# EAGLE design Esquema (EAGLE 9.6.2)
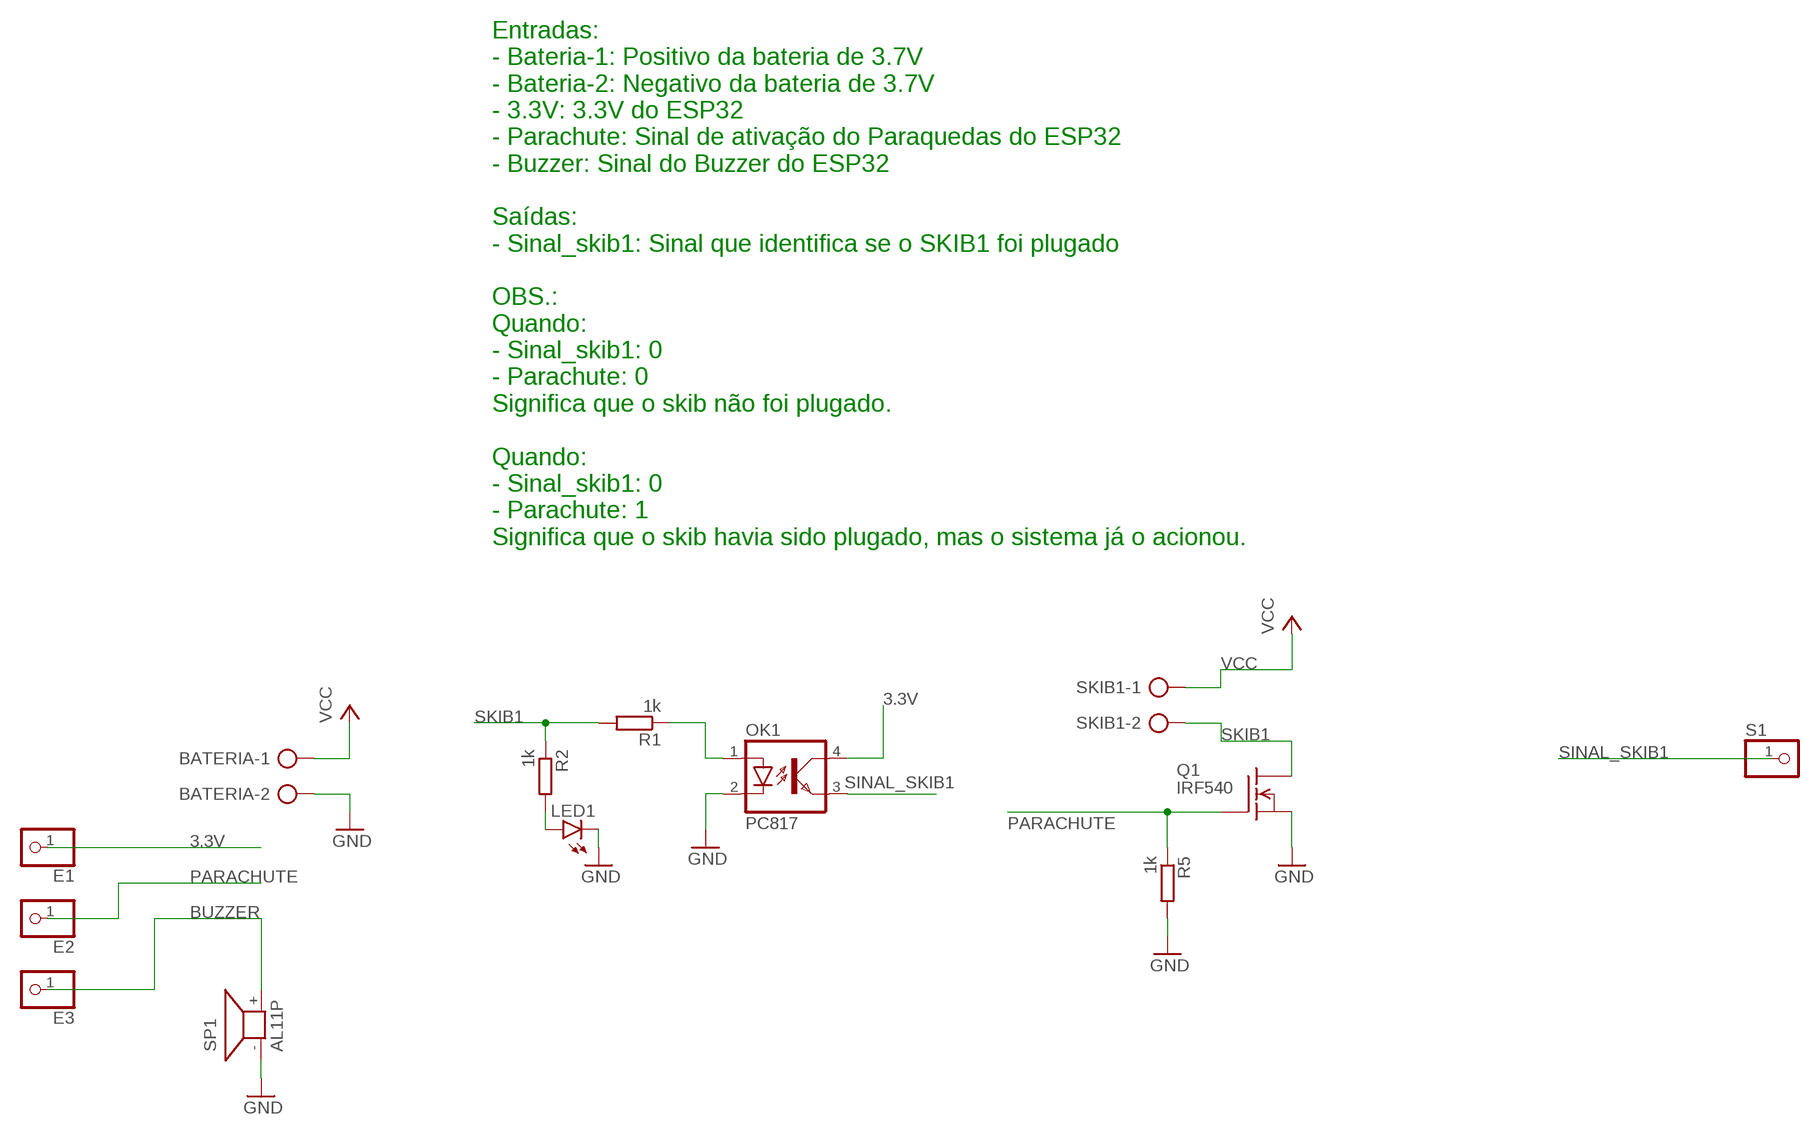
[diagram p0: schematic, sheet 1]

## Parts
BATERIA  AK500/2-H  [AK500/2-H]
E1  PINHD-1X1  [1X01]
E2  PINHD-1X1  [1X01]
E3  PINHD-1X1  [1X01]
LED1  LED5MM  [LED5MM]
OK1  PC817  [DIL04]
Q1  IRF540  [TO220]
R1  1k  R-EU_0207/10  [0207/10]
R2  1k  R-EU_0207/10  [0207/10]
R5  1k  R-EU_0207/10  [0207/10]
S1  PINHD-1X1  [1X01]
SKIB1  AK500/2-H  [AK500/2-H]
SP1  AL11P  [AL11P]

## Nets
3.3V: E1.1 OK1.4(COL)
BUZZER: E3.1 SP1.+
GND: BATERIA.2 LED1.K(C) OK1.2(C) Q1.3(S) R5.2 SP1.-
N$1: OK1.1(A) R1.1
N$4: LED1.A R2.2
PARACHUTE: E2.1 Q1.1(G) R5.1
SINAL_SKIB1: OK1.3(EMIT) S1.1
SKIB1: Q1.2(D) R1.2 R2.1 SKIB1.2
VCC: BATERIA.1 SKIB1.1

## Notes on the sheet
- Entradas:
  - Bateria-1: Positivo da bateria de 3.7V
  - Bateria-2: Negativo da bateria de 3.7V
  - 3.3V: 3.3V do ESP32
  - Parachute: Sinal de ativação do Paraquedas do ESP32
  - Buzzer: Sinal do Buzzer do ESP32
  
  Saídas:
  - Sinal_skib1: Sinal que identifica se o SKIB1 foi plugado
  
  OBS.:
  Quando:
  - Sinal_skib1: 0
  - Parachute: 0
  Significa que o skib não foi plugado.
  
  Quando:
  - Sinal_skib1: 0
  - Parachute: 1
  Significa que o skib havia sido plugado, mas o sistema já o acionou.

## Library data of the parts
BATERIA SKIB1 = con-ptr500:AK500/2-H: CONNECTOR Aug. 2004 / PTR Meßtechnik: Die Bezeichnung der Serie AK505 wurde geändert. Es handelt sich hierbei um AK500 in horizontaler Ausführung.; OC_FARNELL: unknown; OC_NEWARK: unknown
E1-E3 S1 = pinhead:PINHD-1X1: PIN HEADER
LED1 = led:LED: LED OSRAM: - CHIPLED LG R971, LG N971, LY N971, LG Q971, LY Q971, LO R971, LY R971 LH N974, LH R974 LS Q976, LO Q976, LY Q976 LO Q996 - Hyper CHIPLED LW Q18S LB Q993, LB Q99A, LB R99A - SideLED LS A670, LO A670, LY A670, LG A670, LP A670 LB A673, LV A673, LT A673, LW A673 LH A674 LY A675 LS A676, LA A676, LO A676, LY A676, LW A676 LS A679, LY A679, LG A679 - Hyper Micro SIDELED® LS Y876, LA Y876, LO Y876, LY Y876 LT Y87S - SmartLED LW L88C, LW L88S LB L89C, LB L89S, LG L890 LS L89K, LO L89K, LY L89K LS L896, LA L896, LO L896, LY L896 - TOPLED LS T670, LO T670, LY T670, LG T670, LP T670 LSG T670, LSP T670, LSY T670, LOP T670, LYG T670 LG T671, LOG T671, LSG T671 LB T673, LV T673, LT T673, LW T673 LH T674 LS T676, LA T676, LO T676, LY T676, LB T676, LH T676, LSB T676, LW T676 LB T67C, LV T67C, LT T67C, LS T67K, LO T67K, LY T67K, LW E67C LS E67B, LA E67B, LO E67B, LY E67B, LB E67C, LV E67C, LT E67C LW T67C LS T679, LY T679, LG T679 LS T770, LO T770, LY T770, LG T770, LP T770 LB T773, LV T773, LT T773, LW T773 LH T774 LS E675, LA E675, LY E675, LS T675 LS T776, LA T776, LO T776, LY T776, LB T776 LHGB T686 LT T68C, LB T68C - Hyper Mini TOPLED® LB M676 - Mini TOPLED Santana® LG M470 LS M47K, LO M47K, LY M47K Source: http://www.osram.convergy.de LUXEON: - LUMILED® LXK2-PW12-R00, LXK2-PW12-S00, LXK2-PW14-U00, LXK2-PW14-V00 LXK2-PM12-R00, LXK2-PM12-S00, LXK2-PM14-U00 LXK2-PE12-Q00, LXK2-PE12-R00, LXK2-PE12-S00, LXK2-PE14-T00, LXK2-PE14-U00 LXK2-PB12-K00, LXK2-PB12-L00, LXK2-PB12-M00, LXK2-PB14-N00, LXK2-PB14-P00, LXK2-PB14-Q00 LXK2-PR12-L00, LXK2-PR12-M00, LXK2-PR14-Q00, LXK2-PR14-R00 LXK2-PD12-Q00, LXK2-PD12-R00, LXK2-PD12-S00 LXK2-PH12-R00, LXK2-PH12-S00 LXK2-PL12-P00, LXK2-PL12-Q00, LXK2-PL12-R00 Source: www.luxeon.com KINGBRIGHT: KA-3528ASYC Source: www.kingbright.com
OK1 = optocoupler:PC817: SHARP OPTO COUPLER; MPN: PC817X4J000F; OC_FARNELL: 9707727; OC_NEWARK: 97K7059
Q1 = transistor-fet:IRF540: N-Channel Enhancement MOSFET (HEXFET); 100V; 28A; 0,077Ohm
R1 R2 R5 = rcl:R-EU_: RESISTOR, European symbol; SPICEPREFIX: R
SP1 = buzzer:AL11P: SPEAKER Source: Buerklin; OC_FARNELL: unknown; OC_NEWARK: unknown

## Board
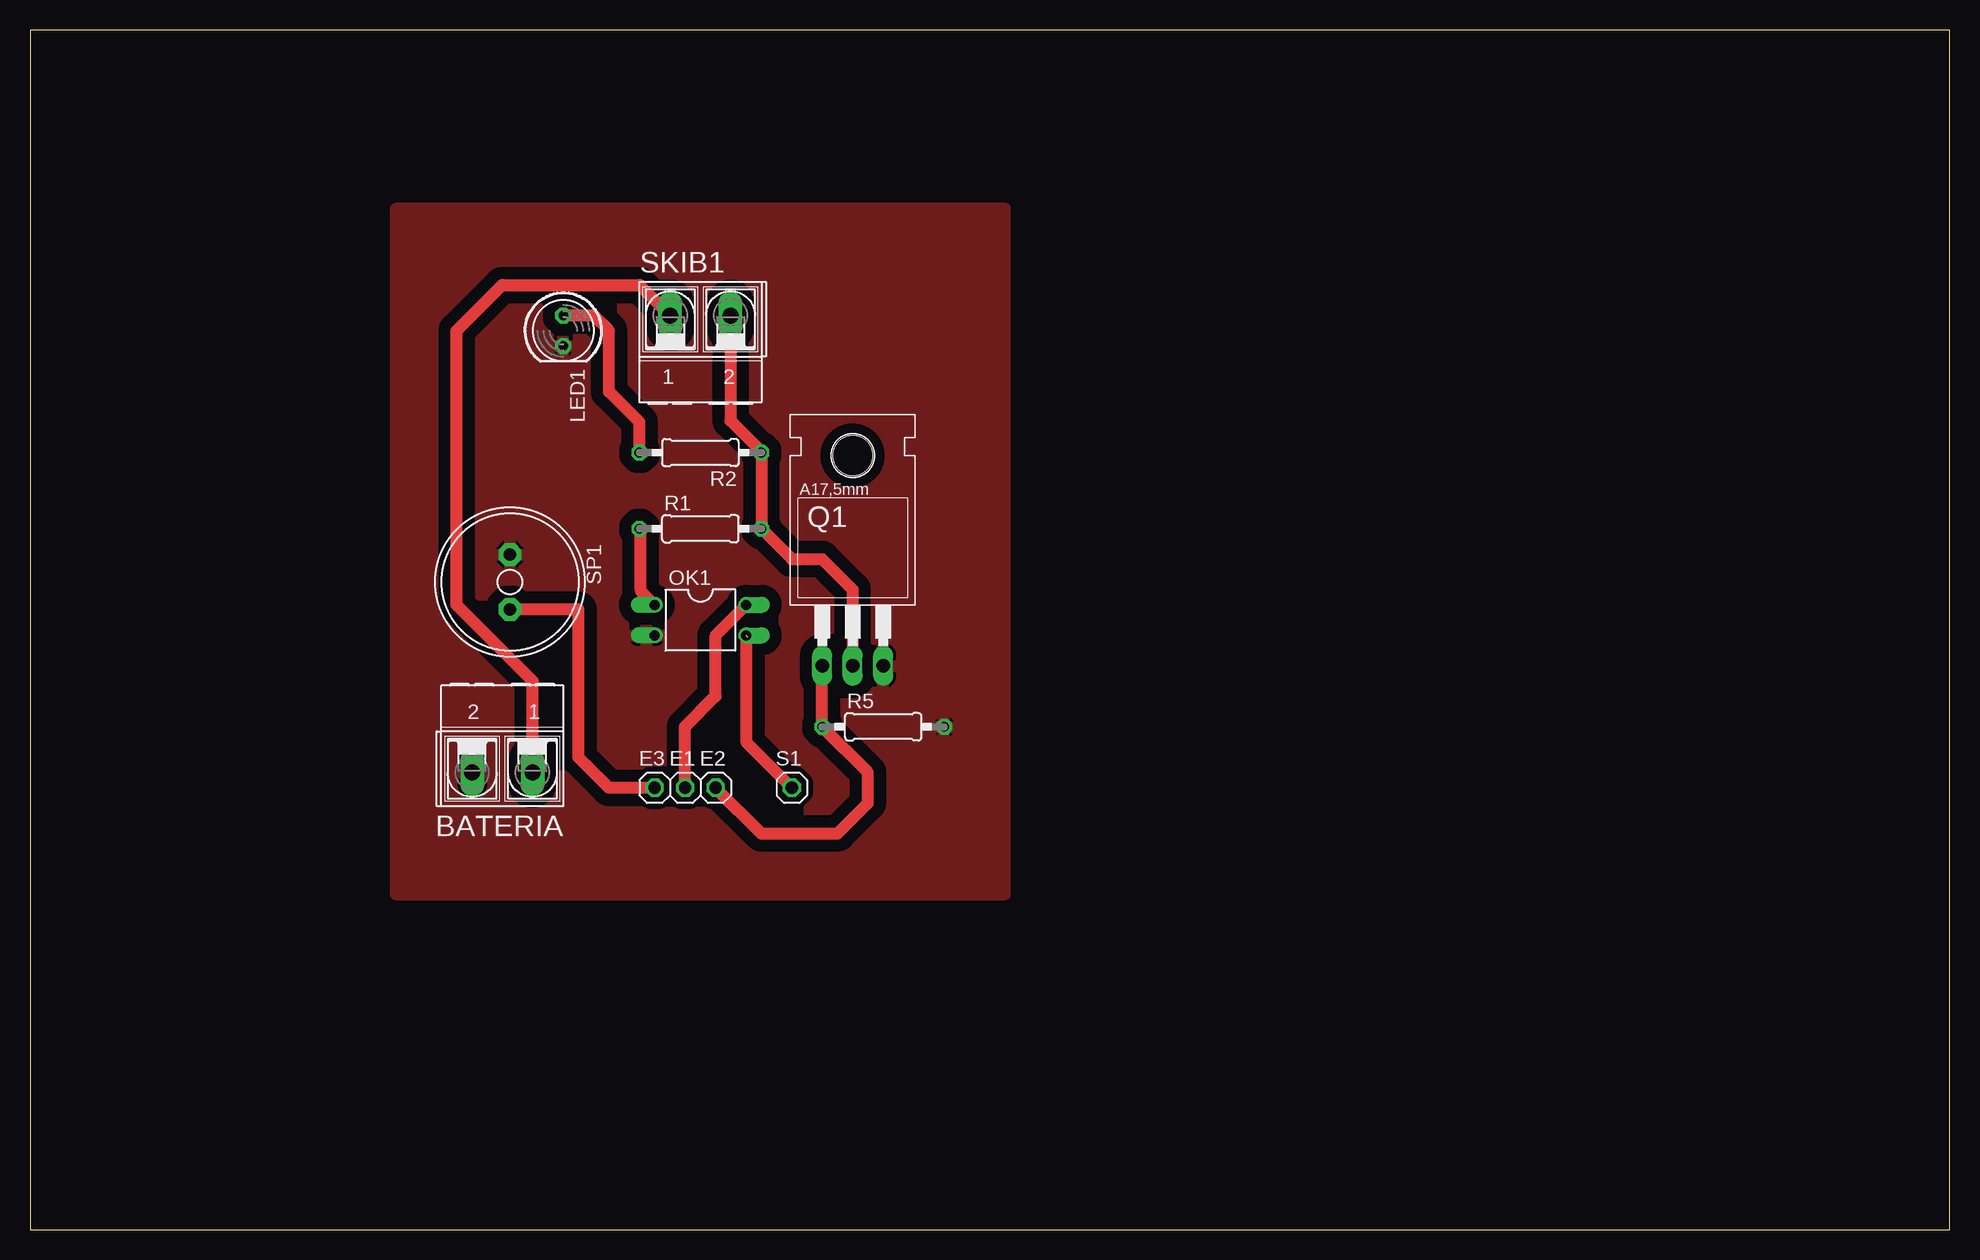
[diagram p1: board, top side]
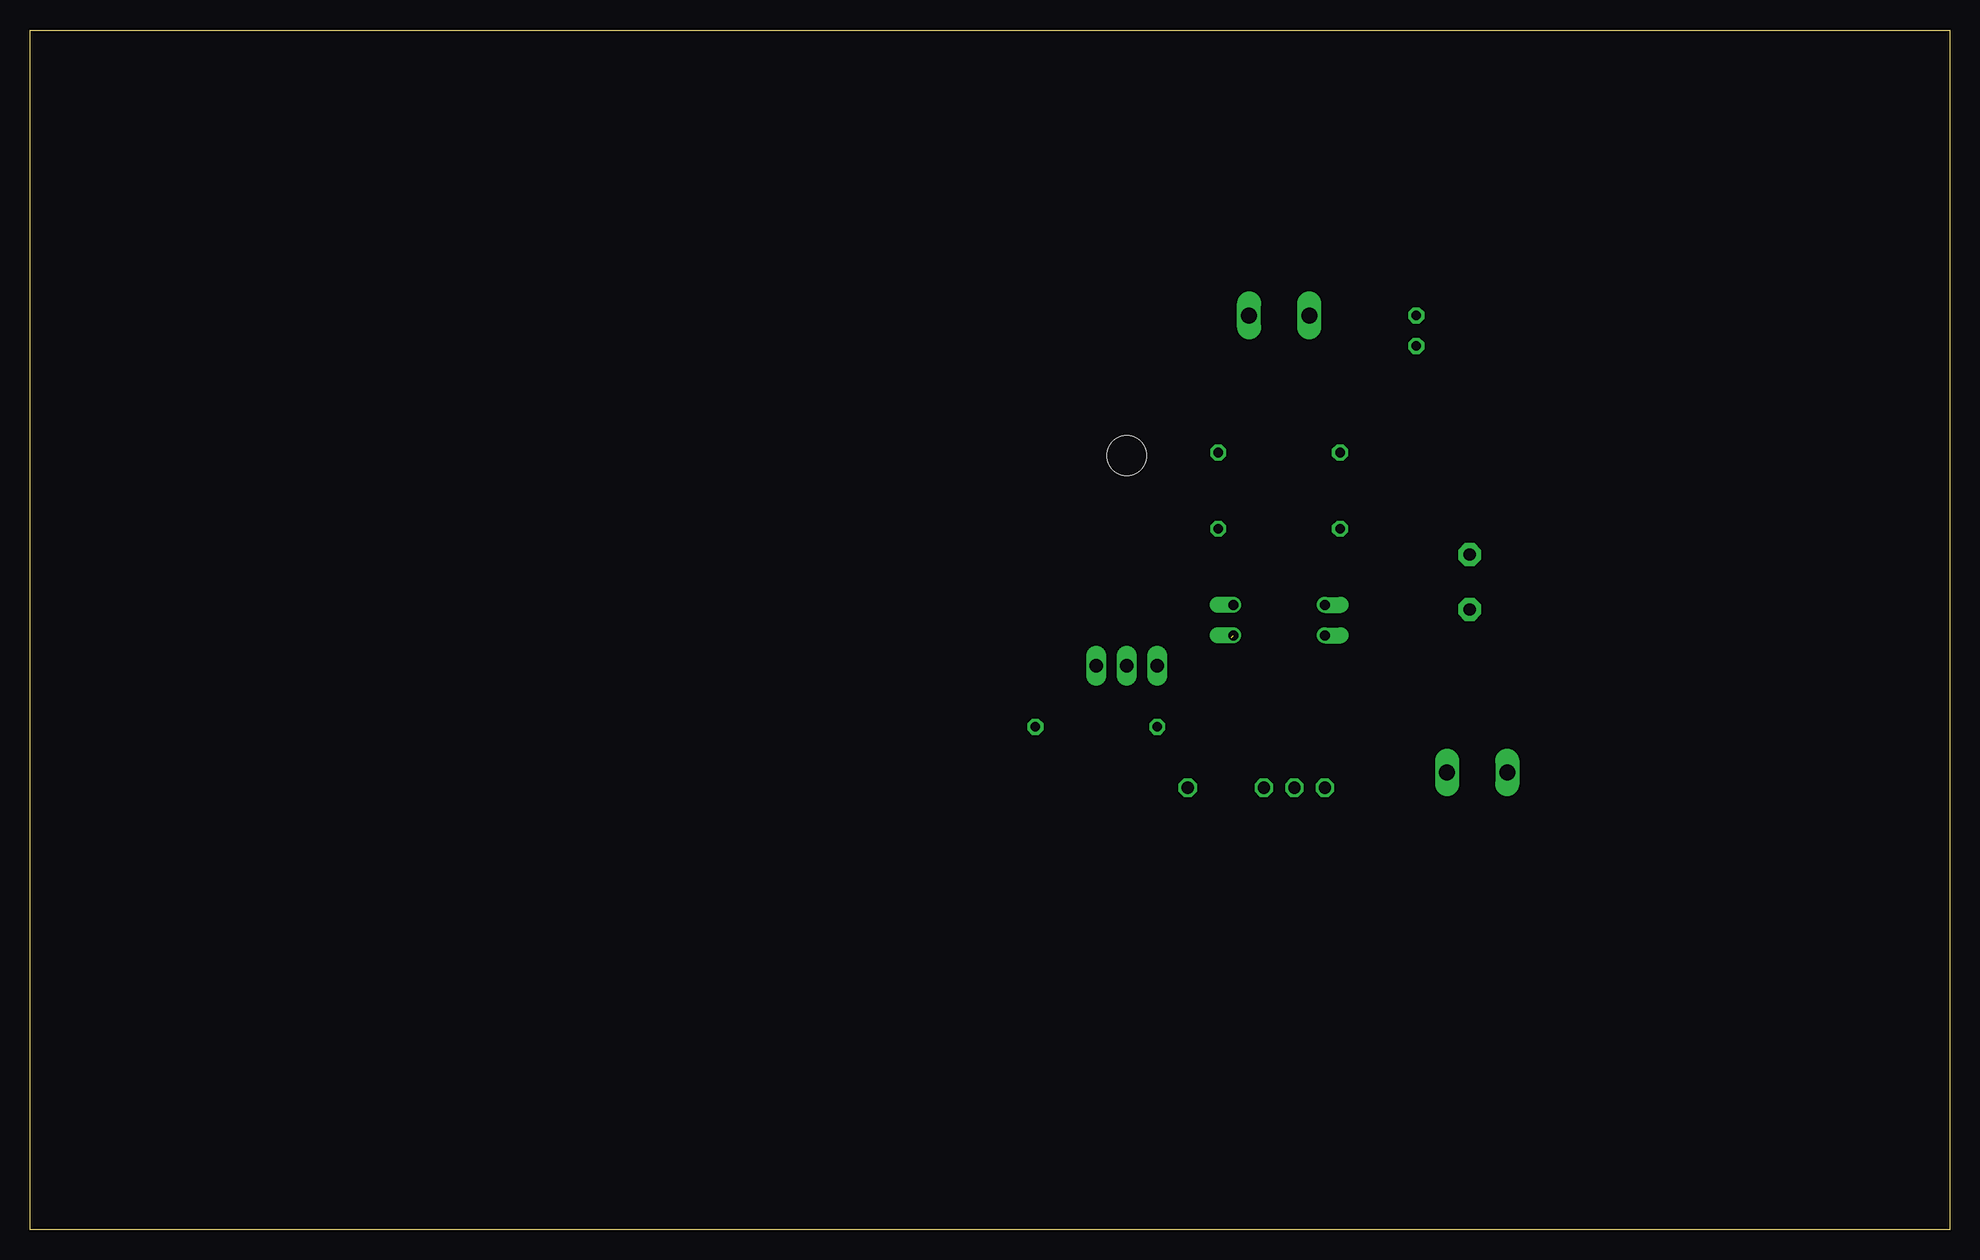
[diagram p2: board, bottom side, seen from below]

Size 160 x 100 mm. Coordinates in mm from the lower left corner, seen from the top.
Outline: 0,0 160,0 160,100 0,100 0,0
Copper layers (1*16): Top 0.035mm / dielectric 1.5mm / Bottom 0.035mm
Design rules "default *": minimum track width 1mm, minimum drill 0.35mm, track to track 40mil, track to pad 0.5mm, pad to pad 6mil, via to via 6mil, smd to smd 6mil, copper to edge 40mil, drill to drill 6mil, minimum pad ring 10mil, minimum via ring 8mil, stop-mask expansion 4mil, vias tented up to drill 0mil, thermal gap 10mil

### Footprints (pad centres in the part's own frame; a part is rotated, then mirrored left to right if it is on the bottom)
AK500/2-H = drill 1.321 long: 1 -2.515,0; 2 2.515,0
1X01 = drill 1.016 octagon: 1 0,0
LED5MM = drill 0.813 octagon: A -1.27,0; K 1.27,0
DIL04 = drill 0.813 offset: 1 -1.27,-3.81; 2 1.27,-3.81; 3 1.27,3.81; 4 -1.27,3.81
TO220 = drill 1.118 long: 1 -2.54,-6.35; 2 0,-6.35; 3 2.54,-6.35 | hole 3.302: 0,11.176
0207/10 = drill 0.813 octagon: 1 -5.08,0; 2 5.08,0
AL11P = drill 1.016 pad 1.905 octagon: + 2.286,0; - -2.286,0

### Placement (x,y rotation side)
BATERIA  39.37,38.1 180 top
E1  54.61,36.83 0 top
E2  57.15,36.83 0 top
E3  52.07,36.83 0 top
LED1  44.45,74.93 270 top
OK1  55.88,50.8 270 top
Q1  68.58,53.34 0 top
R1  55.88,58.42 0 top
R2  55.88,64.77 180 top
R5  71.12,41.91 0 top
S1  63.5,36.83 0 top
SKIB1  55.88,76.2 0 top
SP1  40.01,53.98 270 top

### Tracks (layer width: path | path; a pad name or v marks a point on that pad's centre or on a via)
3.3V
  Top 1: E1.1 54.59,36.85 54.59,41.91 57.12,44.45 | 57.15,44.45 57.12,44.45 | OK1.4 57.15,49.53 57.15,44.48 57.12,44.45
BUZZER
  Top 1: E3.1 48.26,36.83 45.72,39.37 45.72,51.69 SP1.+
GND
  Bottom 0.152: 52.12,49.53 OK1.2
  pour Top: 30.48,85.09 30.48,27.94 81.28,27.94 81.28,85.09
N$1
  Top 0.152: 50.9,58.37 R1.1
  Top 1: OK1.1 50.9,53.24 50.9,53.34 50.9,58.37
N$4
  Top 1: R2.2 50.8,67.31 48.26,69.85 48.26,74.93 46.99,76.2 LED1.A
PARACHUTE
  Top 1: E2.1 60.96,33.02 67.31,33.02 69.85,35.56 69.85,38.1 R5.1 Q1.1
SINAL_SKIB1  (1 unrouted)
  Top 1: S1.1 59.74,40.59 59.74,49.27 59.85,49.37
SKIB1
  Top 0.152: 60.96,64.87 R2.1
  Top 1: SKIB1.2 58.4,67.44 60.96,64.87 | R2.1 R1.2 63.5,55.88 66.04,55.88 68.58,53.34 Q1.2
VCC
  Top 1: BATERIA.1 41.91,38.12 41.91,45.72 35.56,52.07 35.56,74.93 39.37,78.74 50.83,78.74 SKIB1.1